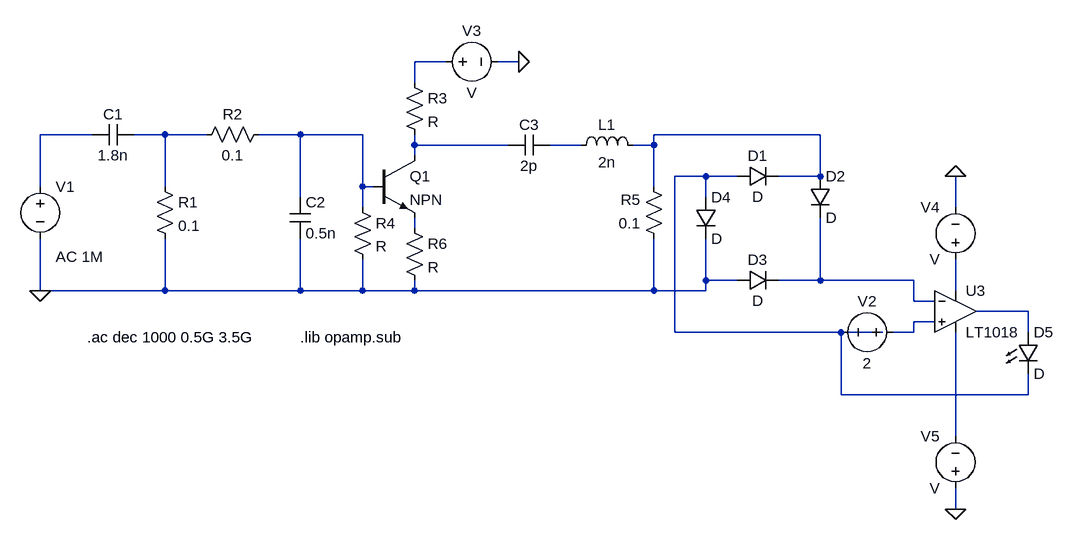
[diagram p0: schematic CellDetec.asc]
CellDetec.asc, the LTspice schematic file:
Version 4
SHEET 1 1036 836
WIRE 80 128 32 128
WIRE 192 128 160 128
WIRE 32 160 32 128
WIRE -464 240 -544 240
WIRE -352 240 -400 240
WIRE -288 240 -352 240
WIRE -144 240 -208 240
WIRE -48 240 -144 240
WIRE 656 240 400 240
WIRE 32 256 32 240
WIRE 176 256 32 256
WIRE 288 256 240 256
WIRE 400 256 400 240
WIRE 400 256 368 256
WIRE 32 272 32 256
WIRE 480 304 432 304
WIRE 528 304 480 304
WIRE 656 304 656 240
WIRE 656 304 592 304
WIRE -544 320 -544 240
WIRE -352 320 -352 240
WIRE -48 320 -48 240
WIRE -32 320 -48 320
WIRE 400 320 400 256
WIRE -144 336 -144 240
WIRE 480 336 480 304
WIRE -48 352 -48 320
WIRE 864 352 864 304
WIRE 32 384 32 368
WIRE 480 464 480 400
WIRE 528 464 480 464
WIRE 656 464 656 368
WIRE 656 464 592 464
WIRE 800 464 656 464
WIRE -544 480 -544 400
WIRE -352 480 -352 400
WIRE -352 480 -544 480
WIRE -144 480 -144 400
WIRE -144 480 -352 480
WIRE -48 480 -48 432
WIRE -48 480 -144 480
WIRE 32 480 32 464
WIRE 32 480 -48 480
WIRE 400 480 400 400
WIRE 400 480 32 480
WIRE 480 480 480 464
WIRE 480 480 400 480
WIRE 864 480 864 432
WIRE 800 496 800 464
WIRE 832 496 800 496
WIRE 976 512 896 512
WIRE 832 528 800 528
WIRE 432 544 432 304
WIRE 688 544 432 544
WIRE 752 544 688 544
WIRE 800 544 800 528
WIRE 800 544 768 544
WIRE 976 544 976 512
WIRE 688 640 688 544
WIRE 976 640 976 608
WIRE 976 640 688 640
WIRE 864 704 864 544
WIRE 864 816 864 784
FLAG -544 480 0
FLAG 192 128 0
FLAG 864 304 0
FLAG 864 816 0
SYMBOL voltage -544 304 R0
WINDOW 123 24 124 Left 2
WINDOW 39 0 0 Left 2
SYMATTR Value2 AC 1M
SYMATTR InstName V1
SYMATTR Value ""
SYMBOL cap -400 224 R90
WINDOW 0 0 32 VBottom 2
WINDOW 3 32 32 VTop 2
SYMATTR InstName C1
SYMATTR Value 1.8n
SYMBOL res -368 304 R0
SYMATTR InstName R1
SYMATTR Value 0.1
SYMBOL res -192 224 R90
WINDOW 0 0 56 VBottom 2
WINDOW 3 32 56 VTop 2
SYMATTR InstName R2
SYMATTR Value 0.1
SYMBOL cap -160 336 R0
SYMATTR InstName C2
SYMATTR Value 0.5n
SYMBOL res 416 416 R180
WINDOW 0 36 76 Left 2
WINDOW 3 36 40 Left 2
SYMATTR InstName R5
SYMATTR Value 0.1
SYMBOL ind 272 272 R270
WINDOW 0 32 56 VTop 2
WINDOW 3 5 56 VBottom 2
SYMATTR InstName L1
SYMATTR Value 2n
SYMBOL cap 176 272 R270
WINDOW 0 32 32 VTop 2
WINDOW 3 0 32 VBottom 2
SYMATTR InstName C3
SYMATTR Value 2p
SYMBOL diode 528 320 R270
WINDOW 0 32 32 VTop 2
WINDOW 3 0 32 VBottom 2
SYMATTR InstName D1
SYMBOL diode 640 304 R0
SYMATTR InstName D2
SYMBOL diode 528 480 R270
WINDOW 0 32 32 VTop 2
WINDOW 3 0 32 VBottom 2
SYMATTR InstName D3
SYMBOL diode 464 336 R0
SYMATTR InstName D4
SYMBOL voltage 784 544 R90
WINDOW 0 -32 56 VBottom 2
WINDOW 3 32 56 VTop 2
WINDOW 123 0 0 Left 2
WINDOW 39 0 0 Left 2
SYMATTR InstName V2
SYMATTR Value 2
SYMBOL LED 960 544 R0
SYMATTR InstName D5
SYMBOL Comparators\\LT1018 864 512 R0
SYMATTR InstName U3
SYMBOL npn -32 272 R0
SYMATTR InstName Q1
SYMBOL res 16 144 R0
SYMATTR InstName R3
SYMBOL res -64 336 R0
SYMATTR InstName R4
SYMBOL voltage 64 128 R270
WINDOW 0 32 56 VTop 2
WINDOW 3 -32 56 VBottom 2
SYMATTR InstName V3
SYMBOL res 16 368 R0
SYMATTR InstName R6
SYMBOL voltage 864 448 R180
WINDOW 0 24 96 Left 2
WINDOW 3 24 16 Left 2
SYMATTR InstName V4
SYMBOL voltage 864 800 R180
WINDOW 0 24 96 Left 2
WINDOW 3 24 16 Left 2
SYMATTR InstName V5
TEXT -472 552 Left 2 !.ac dec 1000 0.5G 3.5G
TEXT -144 552 Left 2 !.lib opamp.sub

The netlist it stands for:
* CellDetec.asc
V1 N002 0 AC 1M
C1 N003 N002 1.8n
R1 N003 0 0.1
R2 N004 N003 0.1
C2 N004 0 0.5n
R5 0 N005 0.1
L1 N007 N005 2n
C3 N006 N007 2p
D1 N008 N005 D
D2 N005 N010 D
D3 0 N010 D
D4 N008 0 D
V2 N013 N008 2
D5 N012 N008 D
XU3 N013 N010 N011 N014 N012 LT1018  ; pins In+ In- V+ V- OUT
Q1 N006 N004 N009 0 NPN
R3 N001 N006 R
R4 N004 0 R
V3 N001 0 V
R6 N009 0 R
V4 N011 0 V
V5 0 N014 V
.model D D
.lib standard.dio
.model NPN NPN
.model PNP PNP
.lib standard.bjt
.ac dec 1000 0.5G 3.5G
.lib opamp.sub
.lib LTC1.lib
.backanno
.end